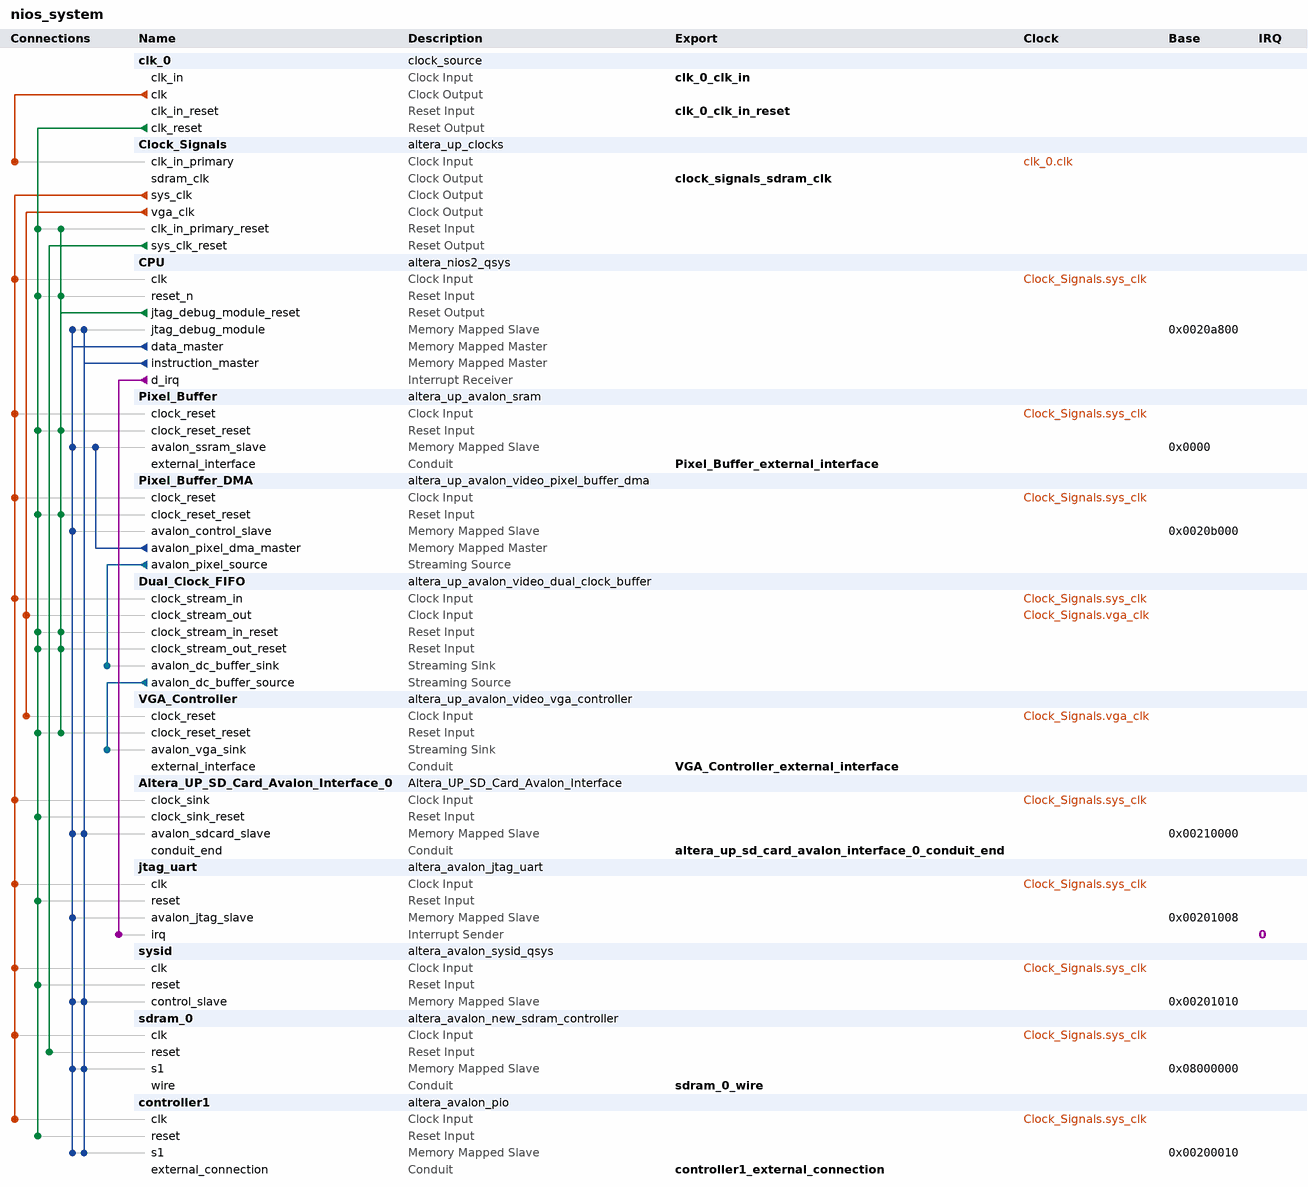
[diagram p0: system contents]
# Platform Designer (Qsys) system nios_system, Cyclone IV GX EP4CGX150DF31C7
# Parameters at their usual value, and those the tool derives, are not listed.
package require -exact qsys 12.1
create_system nios_system
set_project_property DEVICE_FAMILY {Cyclone IV GX}
set_project_property DEVICE EP4CGX150DF31C7

add_instance clk_0 clock_source 12.1
set_instance_parameter_value clk_0 clockFrequency 50000000

add_instance Clock_Signals altera_up_clocks 12.0
set_instance_parameter_value Clock_Signals board DE2-115
set_instance_parameter_value Clock_Signals vga_clk true
set_instance_parameter_value Clock_Signals audio_clk false
set_instance_parameter_value Clock_Signals audio_clk_freq 12.288

add_instance CPU altera_nios2_qsys 12.1
set_instance_parameter_value CPU muldiv_divider true
set_instance_parameter_value CPU manuallyAssignCpuID false
set_instance_parameter_value CPU mmu_TLBMissExcOffset 64
set_instance_parameter_value CPU resetSlave sdram_0.s1
set_instance_parameter_value CPU mmu_TLBMissExcSlave sdram_0.s1
set_instance_parameter_value CPU exceptionSlave sdram_0.s1
set_instance_parameter_value CPU breakSlave CPU.jtag_debug_module
set_instance_parameter_value CPU impl Fast
set_instance_parameter_value CPU icache_size 65536
set_instance_parameter_value CPU dcache_size 65536

add_instance Pixel_Buffer altera_up_avalon_sram 12.0
set_instance_parameter_value Pixel_Buffer board DE2-70
set_instance_parameter_value Pixel_Buffer pixel_buffer true

add_instance Pixel_Buffer_DMA altera_up_avalon_video_pixel_buffer_dma 12.0
set_instance_parameter_value Pixel_Buffer_DMA addr_mode X-Y
set_instance_parameter_value Pixel_Buffer_DMA start_address 0
set_instance_parameter_value Pixel_Buffer_DMA back_start_address 0
set_instance_parameter_value Pixel_Buffer_DMA image_width 640
set_instance_parameter_value Pixel_Buffer_DMA image_height 480
set_instance_parameter_value Pixel_Buffer_DMA color_space {30-bit RGB}

add_instance Dual_Clock_FIFO altera_up_avalon_video_dual_clock_buffer 12.0
set_instance_parameter_value Dual_Clock_FIFO color_bits 10

add_instance VGA_Controller altera_up_avalon_video_vga_controller 12.0
set_instance_parameter_value VGA_Controller board DE2-115

add_instance Altera_UP_SD_Card_Avalon_Interface_0 Altera_UP_SD_Card_Avalon_Interface 1.0

add_instance jtag_uart altera_avalon_jtag_uart 12.1
set_instance_parameter_value jtag_uart simInteractiveOptions INTERACTIVE_ASCII_OUTPUT

add_instance sysid altera_avalon_sysid_qsys 12.1
set_instance_parameter_value sysid id -252645136

add_instance sdram_0 altera_avalon_new_sdram_controller 12.1
set_instance_parameter_value sdram_0 TAC 5.5
set_instance_parameter_value sdram_0 TRCD 20.0
set_instance_parameter_value sdram_0 TRP 20.0
set_instance_parameter_value sdram_0 casLatency 3
set_instance_parameter_value sdram_0 columnWidth 10
set_instance_parameter_value sdram_0 dataWidth 32
set_instance_parameter_value sdram_0 generateSimulationModel false
set_instance_parameter_value sdram_0 model custom
set_instance_parameter_value sdram_0 numberOfBanks 4
set_instance_parameter_value sdram_0 numberOfChipSelects 1
set_instance_parameter_value sdram_0 powerUpDelay 200.0
set_instance_parameter_value sdram_0 refreshPeriod 7.8125
set_instance_parameter_value sdram_0 rowWidth 13

add_instance controller1 altera_avalon_pio 12.1
set_instance_parameter_value controller1 direction Input
set_instance_parameter_value controller1 width 8

# connections
add_connection clk_0.clk Clock_Signals.clk_in_primary clock
add_connection Clock_Signals.sys_clk Altera_UP_SD_Card_Avalon_Interface_0.clock_sink clock
add_connection Clock_Signals.sys_clk controller1.clk clock
add_connection Clock_Signals.sys_clk CPU.clk clock
add_connection Clock_Signals.sys_clk Dual_Clock_FIFO.clock_stream_in clock
add_connection Clock_Signals.sys_clk jtag_uart.clk clock
add_connection Clock_Signals.sys_clk Pixel_Buffer.clock_reset clock
add_connection Clock_Signals.sys_clk Pixel_Buffer_DMA.clock_reset clock
add_connection Clock_Signals.sys_clk sdram_0.clk clock
add_connection Clock_Signals.sys_clk sysid.clk clock
add_connection Clock_Signals.vga_clk Dual_Clock_FIFO.clock_stream_out clock
add_connection Clock_Signals.vga_clk VGA_Controller.clock_reset clock
add_connection clk_0.clk_reset Altera_UP_SD_Card_Avalon_Interface_0.clock_sink_reset reset
add_connection clk_0.clk_reset Clock_Signals.clk_in_primary_reset reset
add_connection clk_0.clk_reset controller1.reset reset
add_connection clk_0.clk_reset CPU.reset_n reset
add_connection clk_0.clk_reset Dual_Clock_FIFO.clock_stream_in_reset reset
add_connection clk_0.clk_reset Dual_Clock_FIFO.clock_stream_out_reset reset
add_connection clk_0.clk_reset jtag_uart.reset reset
add_connection clk_0.clk_reset Pixel_Buffer.clock_reset_reset reset
add_connection clk_0.clk_reset Pixel_Buffer_DMA.clock_reset_reset reset
add_connection clk_0.clk_reset sysid.reset reset
add_connection clk_0.clk_reset VGA_Controller.clock_reset_reset reset
add_connection Clock_Signals.sys_clk_reset sdram_0.reset reset
add_connection CPU.jtag_debug_module_reset Clock_Signals.clk_in_primary_reset reset
add_connection CPU.jtag_debug_module_reset CPU.reset_n reset
add_connection CPU.jtag_debug_module_reset Dual_Clock_FIFO.clock_stream_in_reset reset
add_connection CPU.jtag_debug_module_reset Dual_Clock_FIFO.clock_stream_out_reset reset
add_connection CPU.jtag_debug_module_reset Pixel_Buffer.clock_reset_reset reset
add_connection CPU.jtag_debug_module_reset Pixel_Buffer_DMA.clock_reset_reset reset
add_connection CPU.jtag_debug_module_reset VGA_Controller.clock_reset_reset reset
add_connection CPU.data_master Altera_UP_SD_Card_Avalon_Interface_0.avalon_sdcard_slave avalon
set_connection_parameter_value CPU.data_master/Altera_UP_SD_Card_Avalon_Interface_0.avalon_sdcard_slave baseAddress 0x00210000
add_connection CPU.data_master controller1.s1 avalon
set_connection_parameter_value CPU.data_master/controller1.s1 baseAddress 0x00200010
add_connection CPU.data_master CPU.jtag_debug_module avalon
set_connection_parameter_value CPU.data_master/CPU.jtag_debug_module baseAddress 0x0020a800
add_connection CPU.data_master jtag_uart.avalon_jtag_slave avalon
set_connection_parameter_value CPU.data_master/jtag_uart.avalon_jtag_slave baseAddress 0x00201008
add_connection CPU.data_master Pixel_Buffer.avalon_ssram_slave avalon
set_connection_parameter_value CPU.data_master/Pixel_Buffer.avalon_ssram_slave baseAddress 0x0000
add_connection CPU.data_master Pixel_Buffer_DMA.avalon_control_slave avalon
set_connection_parameter_value CPU.data_master/Pixel_Buffer_DMA.avalon_control_slave baseAddress 0x0020b000
add_connection CPU.data_master sdram_0.s1 avalon
set_connection_parameter_value CPU.data_master/sdram_0.s1 baseAddress 0x08000000
add_connection CPU.data_master sysid.control_slave avalon
set_connection_parameter_value CPU.data_master/sysid.control_slave baseAddress 0x00201010
add_connection CPU.instruction_master Altera_UP_SD_Card_Avalon_Interface_0.avalon_sdcard_slave avalon
set_connection_parameter_value CPU.instruction_master/Altera_UP_SD_Card_Avalon_Interface_0.avalon_sdcard_slave baseAddress 0x00210000
add_connection CPU.instruction_master controller1.s1 avalon
set_connection_parameter_value CPU.instruction_master/controller1.s1 baseAddress 0x00200010
add_connection CPU.instruction_master CPU.jtag_debug_module avalon
set_connection_parameter_value CPU.instruction_master/CPU.jtag_debug_module baseAddress 0x0020a800
add_connection CPU.instruction_master sdram_0.s1 avalon
set_connection_parameter_value CPU.instruction_master/sdram_0.s1 baseAddress 0x08000000
add_connection CPU.instruction_master sysid.control_slave avalon
set_connection_parameter_value CPU.instruction_master/sysid.control_slave baseAddress 0x00201010
add_connection Pixel_Buffer_DMA.avalon_pixel_dma_master Pixel_Buffer.avalon_ssram_slave avalon
set_connection_parameter_value Pixel_Buffer_DMA.avalon_pixel_dma_master/Pixel_Buffer.avalon_ssram_slave baseAddress 0x0000
add_connection Dual_Clock_FIFO.avalon_dc_buffer_source VGA_Controller.avalon_vga_sink avalon_streaming
add_connection Pixel_Buffer_DMA.avalon_pixel_source Dual_Clock_FIFO.avalon_dc_buffer_sink avalon_streaming
add_connection CPU.d_irq jtag_uart.irq interrupt
set_connection_parameter_value CPU.d_irq/jtag_uart.irq irqNumber 0

# exported interfaces
add_interface VGA_Controller_external_interface conduit end
set_interface_property VGA_Controller_external_interface EXPORT_OF VGA_Controller.external_interface
add_interface clk_0_clk_in clock sink
set_interface_property clk_0_clk_in EXPORT_OF clk_0.clk_in
add_interface clk_0_clk_in_reset reset sink
set_interface_property clk_0_clk_in_reset EXPORT_OF clk_0.clk_in_reset
add_interface Pixel_Buffer_external_interface conduit end
set_interface_property Pixel_Buffer_external_interface EXPORT_OF Pixel_Buffer.external_interface
add_interface altera_up_sd_card_avalon_interface_0_conduit_end conduit end
set_interface_property altera_up_sd_card_avalon_interface_0_conduit_end EXPORT_OF Altera_UP_SD_Card_Avalon_Interface_0.conduit_end
add_interface sdram_0_wire conduit end
set_interface_property sdram_0_wire EXPORT_OF sdram_0.wire
add_interface clock_signals_sdram_clk clock source
set_interface_property clock_signals_sdram_clk EXPORT_OF Clock_Signals.sdram_clk
add_interface controller1_external_connection conduit end
set_interface_property controller1_external_connection EXPORT_OF controller1.external_connection

save_system nios_system.qsys
